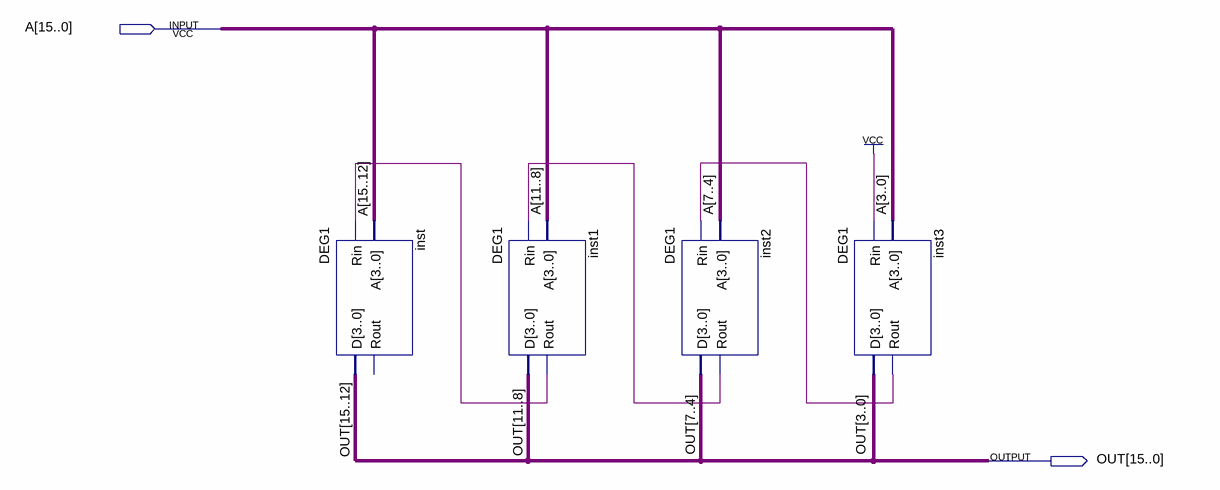
[diagram p0: schematic sheet]
// Quartus schematic 16BITDEG1.bdf as structural Verilog: 4 symbols, 2 pins
module \16BITDEG1  (
  input  [15:0] A,
  output [15:0] OUT
);

  wire inst1_rout, inst2_rout, inst3_rout;

  DEG1 inst (.Rin(inst1_rout), .A(A[15:12]), .D(OUT[15:12]));  // open: Rout
  DEG1 inst1 (.Rin(inst2_rout), .A(A[11:8]), .D(OUT[11:8]), .Rout(inst1_rout));
  DEG1 inst2 (.Rin(inst3_rout), .A(A[7:4]), .D(OUT[7:4]), .Rout(inst2_rout));
  DEG1 inst3 (.Rin(1'b1), .A(A[3:0]), .D(OUT[3:0]), .Rout(inst3_rout));
endmodule
